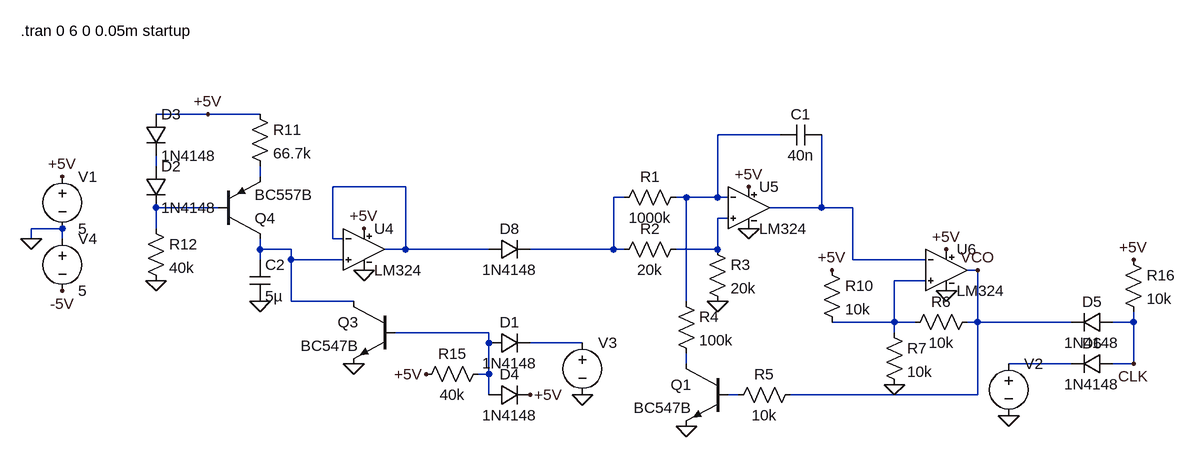
[diagram p0: schematic osc.asc]
osc.asc, the LTspice schematic file:
Version 4
SHEET 1 1748 680
WIRE -832 0 -912 0
WIRE -752 0 -832 0
WIRE 48 32 -48 32
WIRE -912 80 -912 64
WIRE -752 96 -752 80
WIRE -528 112 -640 112
WIRE -192 128 -208 128
WIRE -96 128 -112 128
WIRE -48 128 -48 32
WIRE -48 128 -96 128
WIRE -32 128 -48 128
WIRE -816 144 -912 144
WIRE 112 144 112 32
WIRE 112 144 32 144
WIRE 160 144 112 144
WIRE -32 160 -48 160
WIRE -1056 176 -1104 176
WIRE -912 176 -912 144
WIRE -1104 192 -1104 176
WIRE -1056 192 -1056 176
WIRE -640 192 -640 112
WIRE -624 192 -640 192
WIRE -752 208 -752 192
WIRE -704 208 -752 208
WIRE -528 208 -528 112
WIRE -528 208 -560 208
WIRE -400 208 -528 208
WIRE -208 208 -208 128
WIRE -208 208 -336 208
WIRE -192 208 -208 208
WIRE -48 208 -48 160
WIRE -48 208 -112 208
WIRE -752 224 -752 208
WIRE -704 224 -704 208
WIRE -624 224 -704 224
WIRE 160 224 160 144
WIRE 272 224 160 224
WIRE 352 240 336 240
WIRE 272 256 224 256
WIRE -704 288 -704 224
WIRE -608 288 -704 288
WIRE -96 288 -96 128
WIRE 224 320 224 256
WIRE 224 320 128 320
WIRE 256 320 224 320
WIRE 352 320 352 240
WIRE 352 320 336 320
WIRE 496 320 352 320
WIRE 592 320 592 304
WIRE 592 320 560 320
WIRE -400 336 -544 336
WIRE 224 336 224 320
WIRE -400 352 -400 336
WIRE -256 352 -336 352
WIRE -96 384 -96 368
WIRE 496 384 400 384
WIRE 592 384 592 320
WIRE 592 384 560 384
WIRE -400 400 -400 352
WIRE -400 400 -416 400
WIRE -400 432 -400 400
WIRE -16 432 -32 432
WIRE 352 432 352 320
WIRE 352 432 64 432
FLAG -1056 96 +5V
FLAG 0 112 +5V
FLAG 304 208 +5V
FLAG -48 288 0
FLAG -96 480 0
FLAG 224 416 0
FLAG -752 288 0
FLAG -608 384 0
FLAG -592 176 +5V
FLAG 0 176 0
FLAG 304 272 0
FLAG 128 240 +5V
FLAG -832 0 +5V
FLAG -912 256 0
FLAG -496 400 +5V
FLAG -336 432 +5V
FLAG 592 224 +5V
FLAG 352 240 VCO
FLAG 592 384 CLK
FLAG 400 464 0
FLAG -1056 272 -5V
FLAG -1104 192 0
FLAG -592 240 0
FLAG -256 432 0
SYMBOL voltage -1056 80 R0
WINDOW 123 0 0 Left 0
WINDOW 39 0 0 Left 0
SYMATTR InstName V1
SYMATTR Value 5
SYMBOL cap 112 16 R90
WINDOW 0 0 32 VBottom 0
WINDOW 3 32 32 VTop 0
SYMATTR InstName C1
SYMATTR Value 40n
SYMBOL res -208 144 R270
WINDOW 0 32 56 VTop 0
WINDOW 3 0 56 VBottom 0
SYMATTR InstName R1
SYMATTR Value 1000k
SYMBOL res -208 224 R270
WINDOW 0 32 56 VTop 0
WINDOW 3 0 56 VBottom 0
SYMATTR InstName R2
SYMATTR Value 20k
SYMBOL res -64 192 R0
SYMATTR InstName R3
SYMATTR Value 20k
SYMBOL res -112 272 R0
SYMATTR InstName R4
SYMATTR Value 100k
SYMBOL npn -32 384 M0
SYMATTR InstName Q1
SYMATTR Value BC547B
SYMBOL res 80 416 R90
WINDOW 0 0 56 VBottom 0
WINDOW 3 32 56 VTop 0
SYMATTR InstName R5
SYMATTR Value 10k
SYMBOL res 352 304 R90
WINDOW 0 0 56 VBottom 0
WINDOW 3 32 56 VTop 0
SYMATTR InstName R6
SYMATTR Value 10k
SYMBOL res 208 320 R0
SYMATTR InstName R7
SYMATTR Value 10k
SYMBOL cap -768 224 R0
SYMATTR InstName C2
SYMATTR Value 5µ
SYMBOL npn -544 288 M0
SYMATTR InstName Q3
SYMATTR Value BC547B
SYMBOL res 112 224 R0
SYMATTR InstName R10
SYMATTR Value 10k
SYMBOL pnp -816 192 M180
SYMATTR InstName Q4
SYMATTR Value BC557B
SYMBOL diode -928 80 R0
SYMATTR InstName D2
SYMATTR Value 1N4148
SYMBOL diode -928 0 R0
SYMATTR InstName D3
SYMATTR Value 1N4148
SYMBOL res -768 -16 R0
SYMATTR InstName R11
SYMATTR Value 66.7k
SYMBOL res -928 160 R0
SYMATTR InstName R12
SYMATTR Value 40k
SYMBOL diode -400 368 R270
WINDOW 0 32 32 VTop 0
WINDOW 3 0 32 VBottom 0
SYMATTR InstName D1
SYMATTR Value 1N4148
SYMBOL diode -400 448 R270
WINDOW 0 32 32 VTop 0
WINDOW 3 0 32 VBottom 0
SYMATTR InstName D4
SYMATTR Value 1N4148
SYMBOL res -400 384 R90
WINDOW 0 0 56 VBottom 0
WINDOW 3 32 56 VTop 0
SYMATTR InstName R15
SYMATTR Value 40k
SYMBOL diode 560 304 R90
WINDOW 0 0 32 VBottom 0
WINDOW 3 32 32 VTop 0
SYMATTR InstName D5
SYMATTR Value 1N4148
SYMBOL diode 560 368 R90
WINDOW 0 0 32 VBottom 0
WINDOW 3 32 32 VTop 0
SYMATTR InstName D6
SYMATTR Value 1N4148
SYMBOL res 576 208 R0
SYMATTR InstName R16
SYMATTR Value 10k
SYMBOL myLib\\LM324 -592 144 R0
SYMATTR InstName U4
SYMBOL myLib\\LM324 0 80 R0
SYMATTR InstName U5
SYMBOL myLib\\LM324 304 176 R0
SYMATTR InstName U6
SYMBOL voltage -1056 176 R0
WINDOW 123 0 0 Left 0
WINDOW 39 0 0 Left 0
SYMATTR InstName V4
SYMATTR Value 5
SYMBOL voltage 400 368 R0
WINDOW 3 24 104 Invisible 0
WINDOW 123 0 0 Left 0
WINDOW 39 0 0 Left 0
SYMATTR Value PWL file=v2.txt
SYMATTR InstName V2
SYMBOL diode -400 224 R270
WINDOW 0 32 32 VTop 0
WINDOW 3 0 32 VBottom 0
SYMATTR InstName D8
SYMATTR Value 1N4148
SYMBOL voltage -256 336 R0
WINDOW 3 24 104 Invisible 0
WINDOW 123 0 0 Left 0
WINDOW 39 0 0 Left 0
SYMATTR Value PWL file=v3.txt
SYMATTR InstName V3
TEXT -1120 -128 Left 0 !.tran 0 6 0 0.05m startup

The netlist it stands for:
* osc.asc
V1 +5V 0 5
C1 N007 N001 40n
R1 N005 N001 1000k
R2 N005 N008 20k
R3 N008 0 20k
R4 N001 N013 100k
Q1 N013 N015 0 0 BC547B
R5 VCO N015 10k
R6 VCO N010 10k
R7 N010 0 10k
C2 N009 0 5µ
Q3 N009 N011 0 0 BC547B
R10 +5V N010 10k
Q4 N009 N006 N003 0 BC557B
D2 N002 N006 1N4148
D3 +5V N002 1N4148
R11 +5V N003 66.7k
R12 N006 0 40k
D1 N011 N012 1N4148
D4 N011 +5V 1N4148
R15 N011 +5V 40k
D5 CLK VCO 1N4148
D6 CLK N014 1N4148
R16 +5V CLK 10k
XU4 N009 N004 +5V 0 N004 LM324  ; pins In+ In- V+ V- OUT
XU5 N008 N001 +5V 0 N007 LM324  ; pins In+ In- V+ V- OUT
XU6 N010 N007 +5V 0 VCO LM324  ; pins In+ In- V+ V- OUT
V4 0 -5V 5
V2 N014 0 PWL file=v2.txt
D8 N004 N005 1N4148
V3 N012 0 PWL file=v3.txt
.model D D
.lib standard.dio
.model NPN NPN
.model PNP PNP
.lib standard.bjt
.tran 0 6 0 0.05m startup
.lib myLib\LM324.lib
.backanno
.end